# Altium schematic sheet Pacemaker V3_0.SchDoc
size 723 x 392 mm; Origin: Eagle
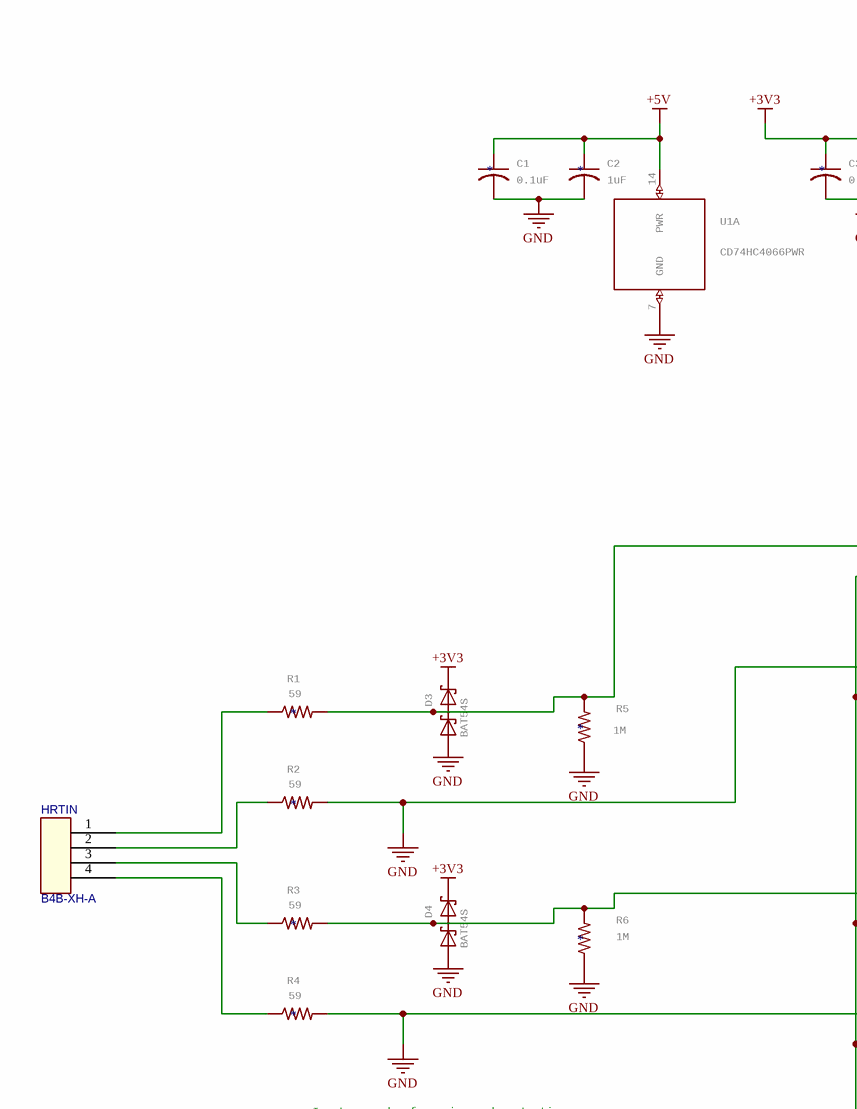
[diagram p0: Pacemaker V3_0.SchDoc, top left]
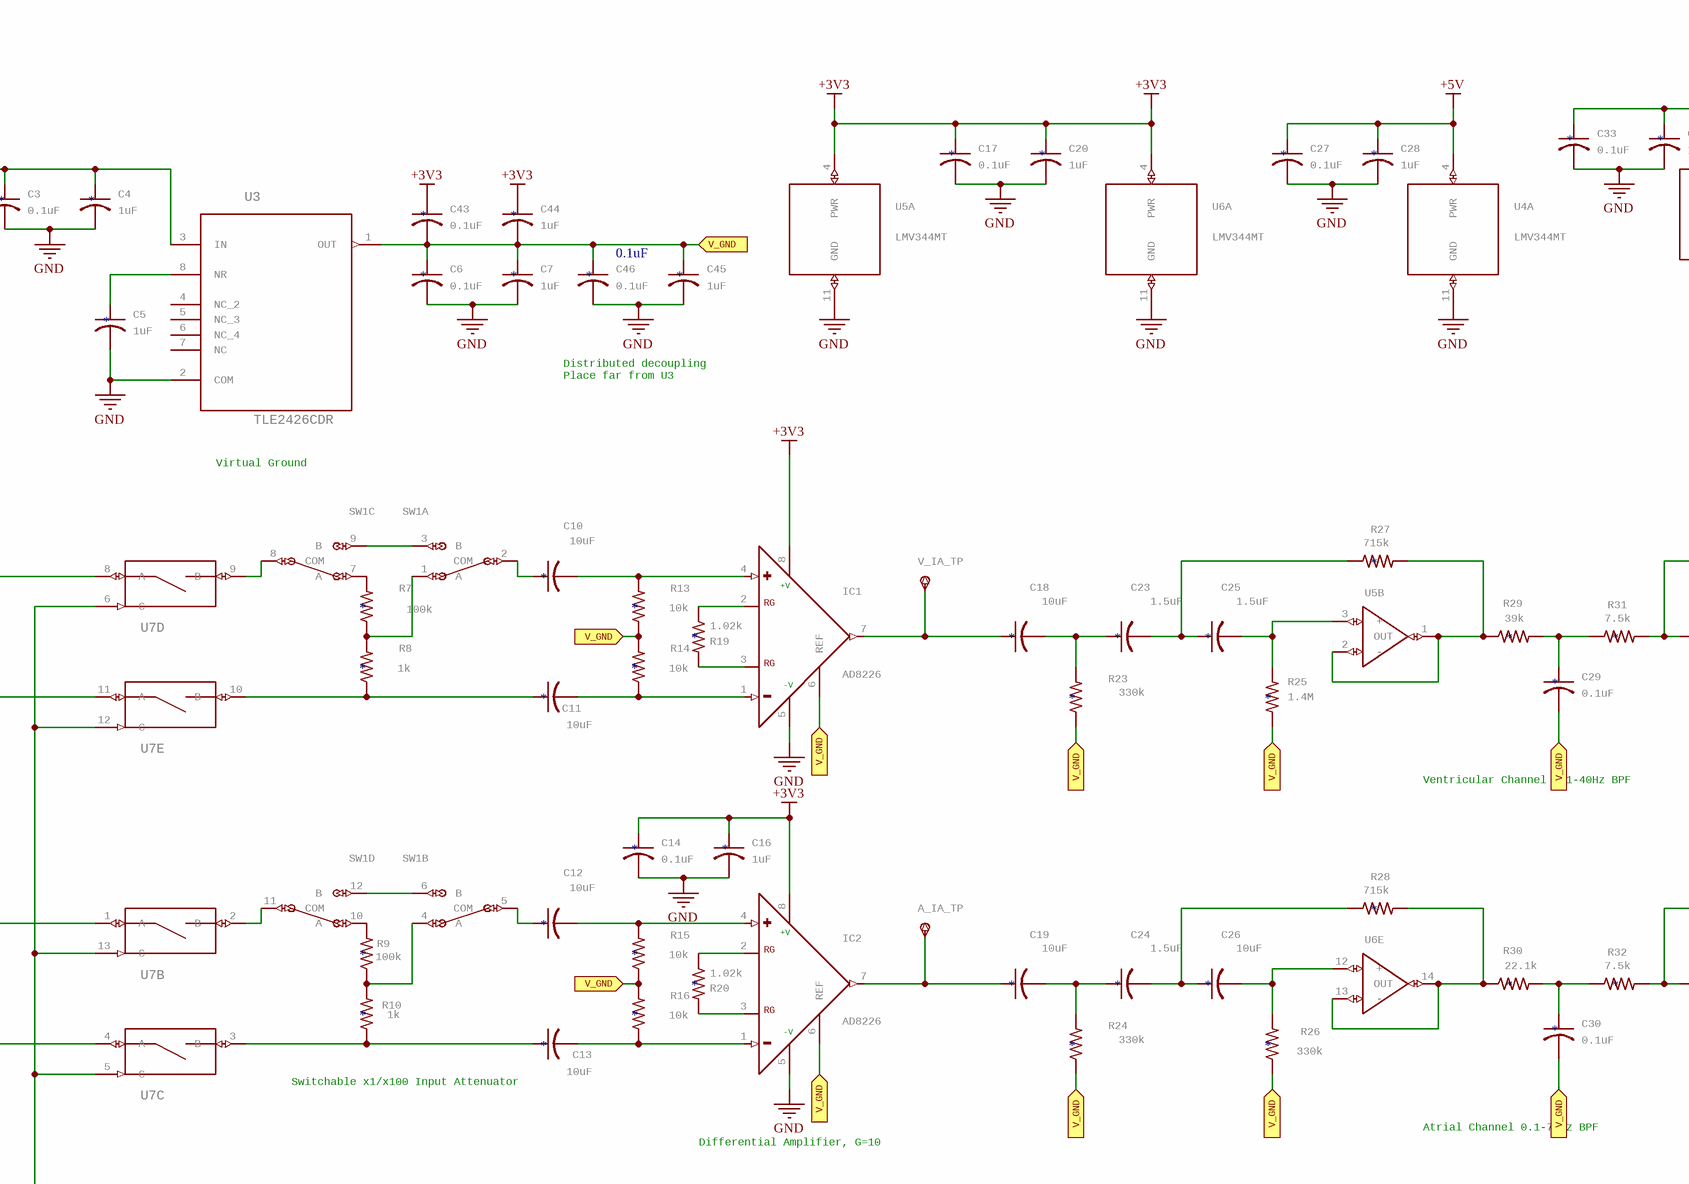
[diagram p1: Pacemaker V3_0.SchDoc, top middle]
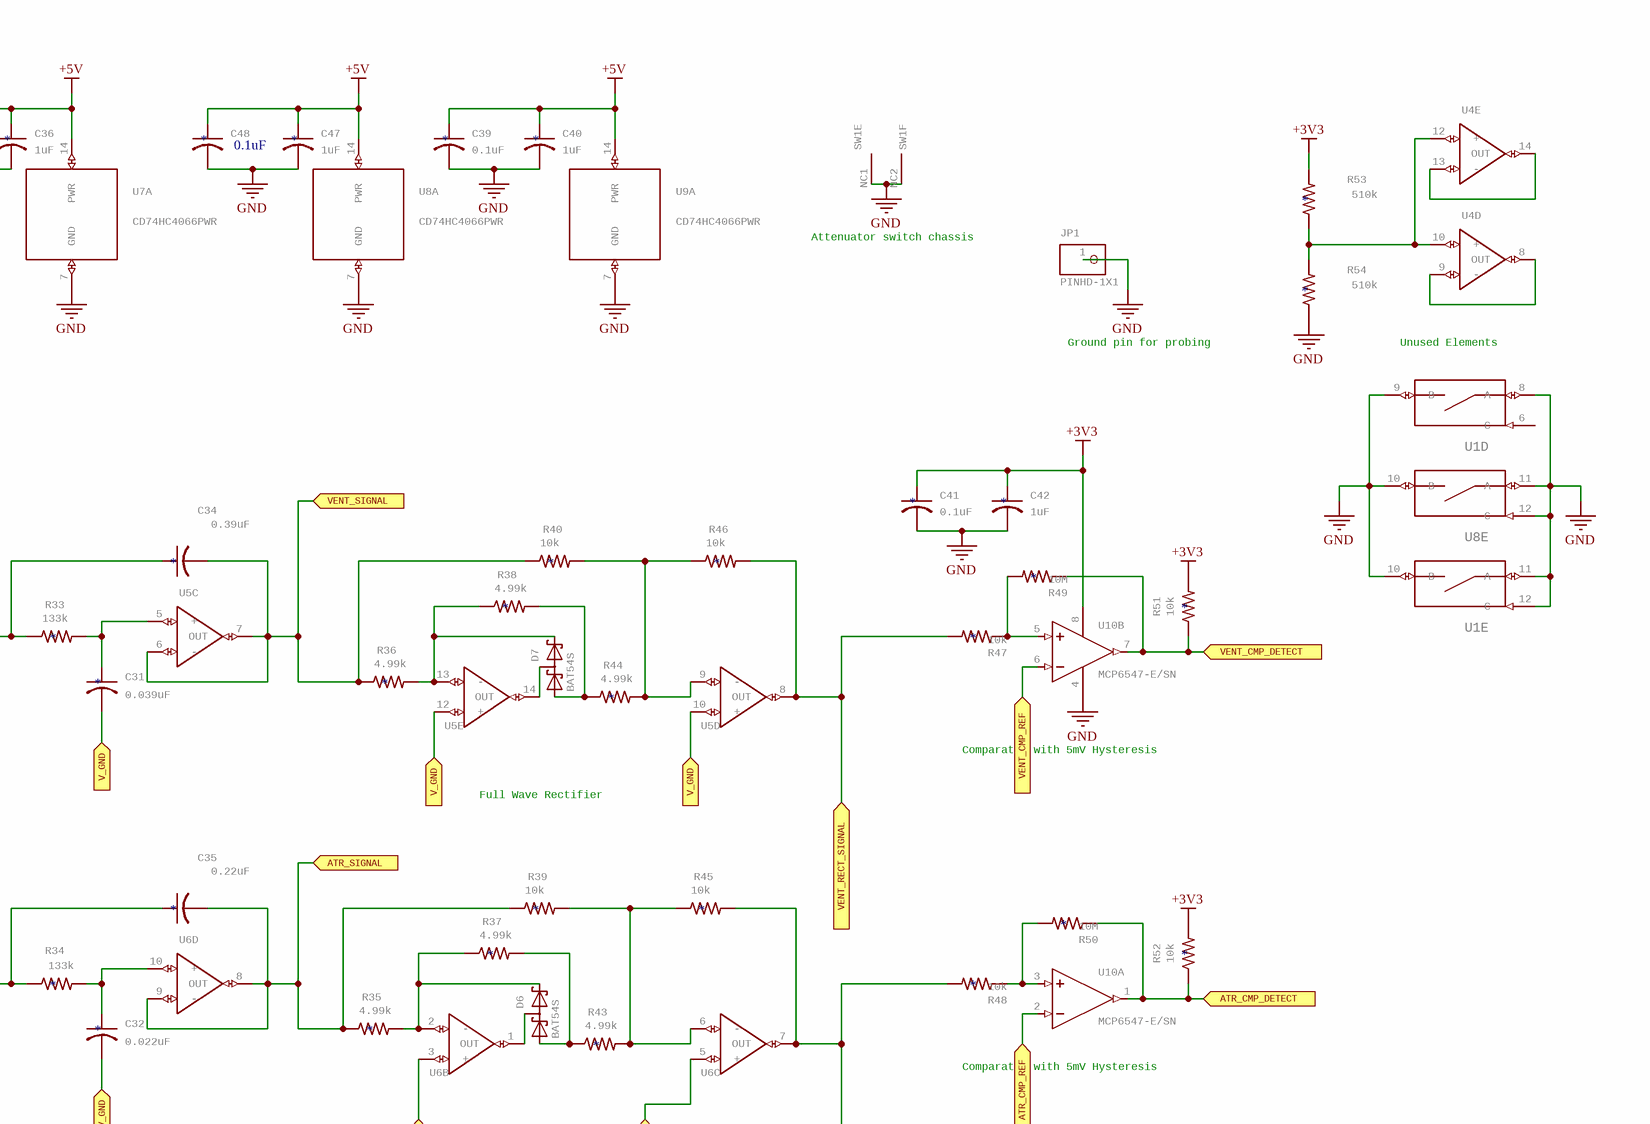
[diagram p2: Pacemaker V3_0.SchDoc, top right]
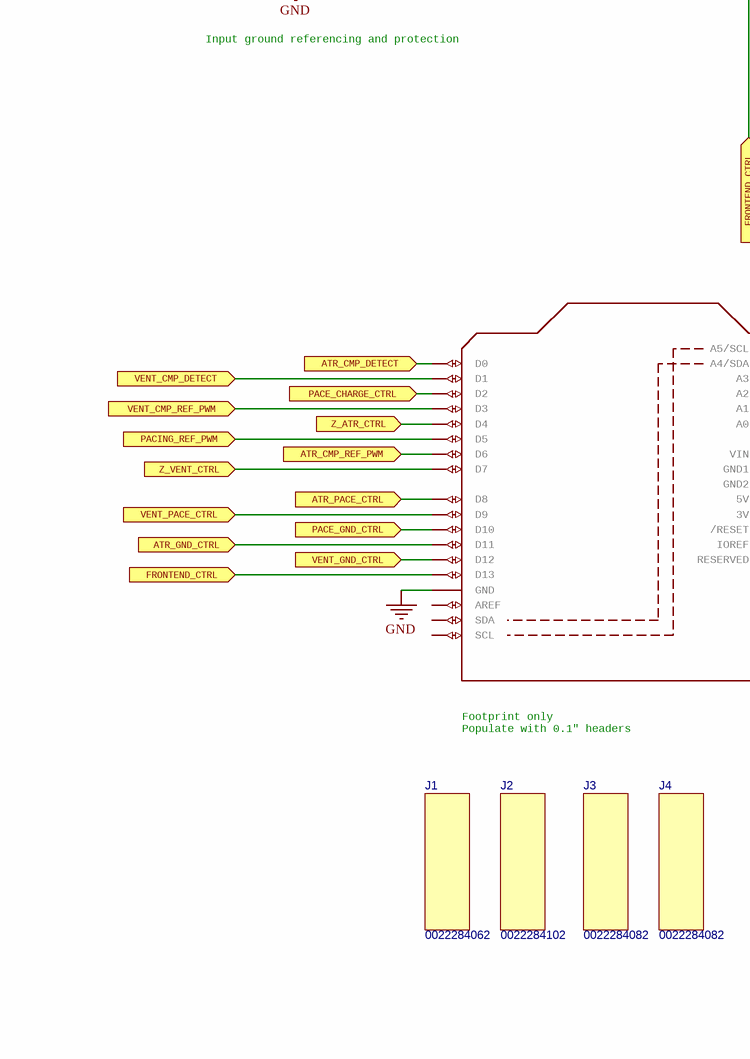
[diagram p3: Pacemaker V3_0.SchDoc, bottom left]
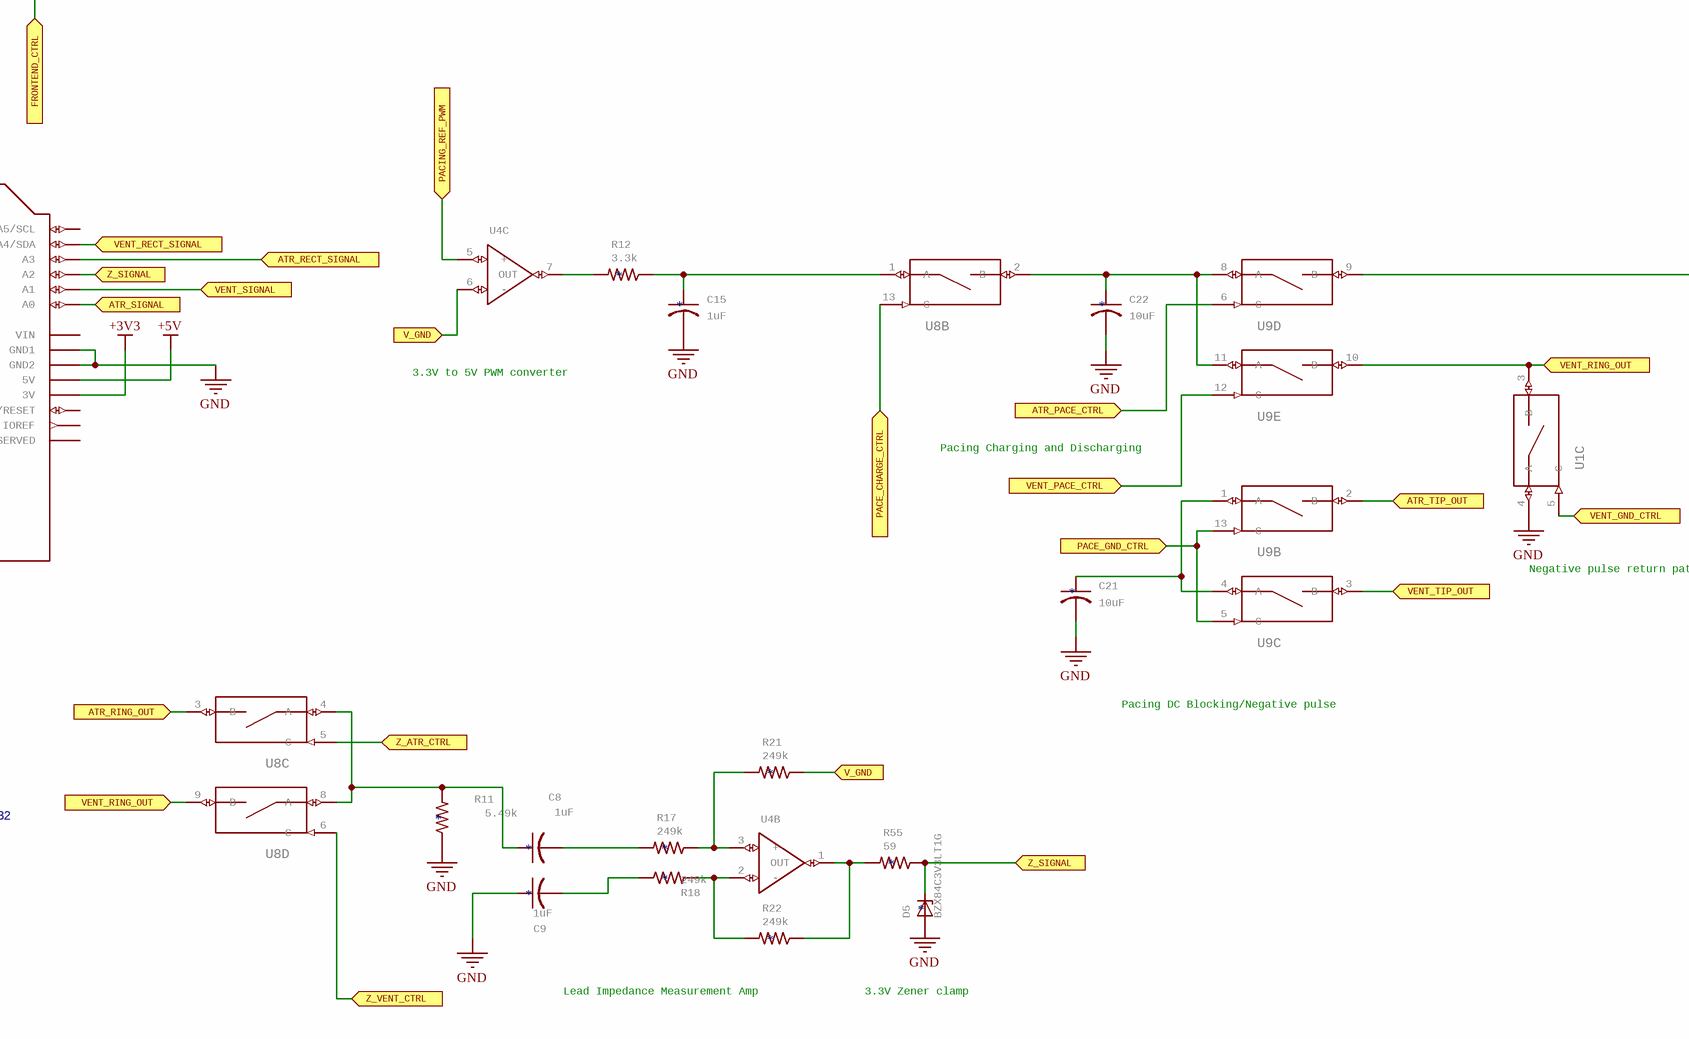
[diagram p4: Pacemaker V3_0.SchDoc, bottom middle]
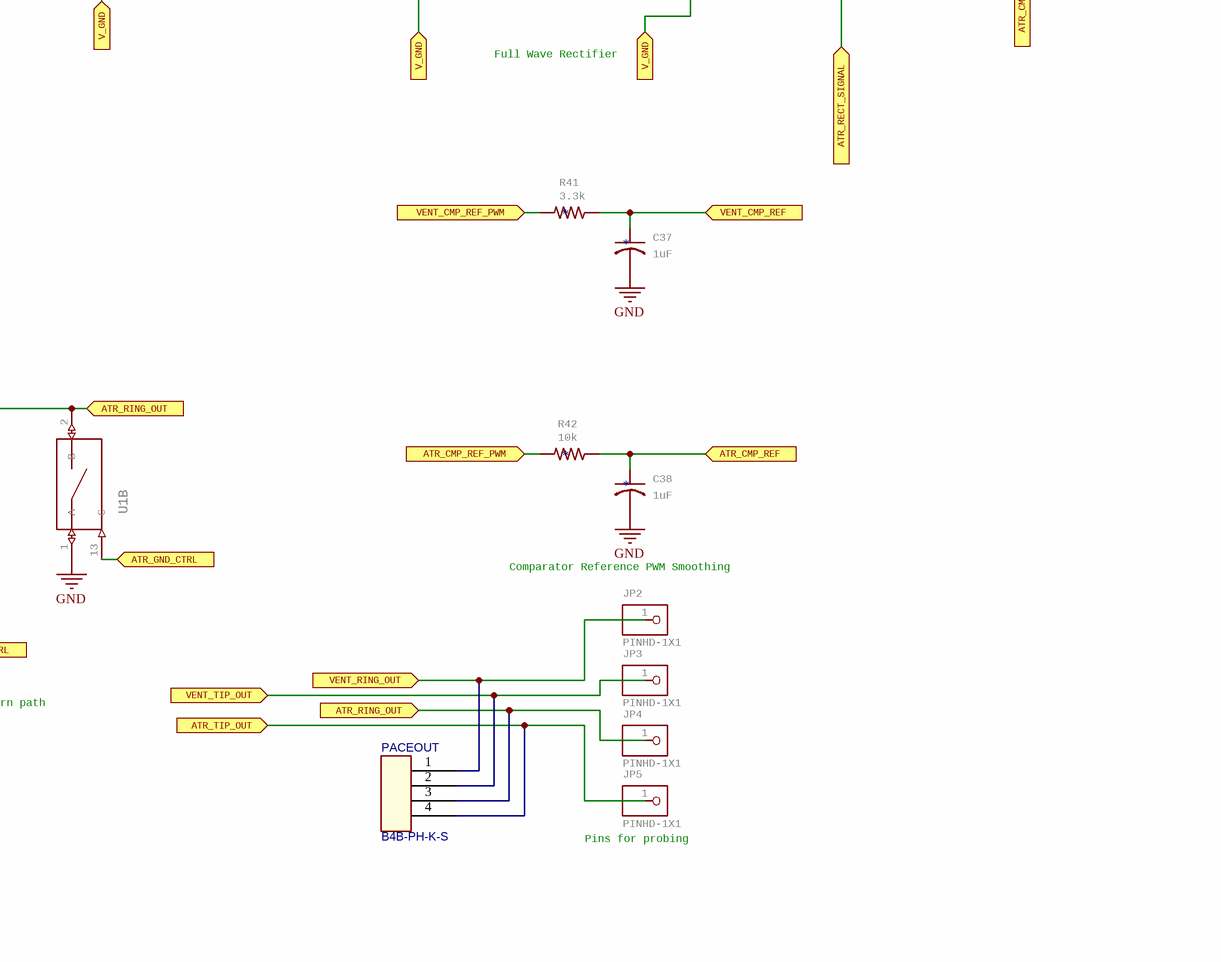
[diagram p5: Pacemaker V3_0.SchDoc, bottom right]

## Parts
A_IA_TP  TPSTP06R  [TP06R]  (value not drawn)
C1  *  value 0.1uF  [C0805]
C2  *  value 1uF  [C0805]
C3  *  value 0.1uF  [C0805]
C4  *  value 1uF  [C0805]
C5  *  value 1uF  [C0805]
C6  *  value 0.1uF  [C0805]
C7  *  value 1uF  [C0805]
C8  *  value 1uF  [C0805]
C9  *  value 1uF  [C0805]
C10  *  value 10uF  [C0805]
C11  *  value 10uF  [C0805]
C12  *  value 10uF  [C0805]
C13  *  value 10uF  [C0805]
C14  *  value 0.1uF  [C0805]
C15  *  value 1uF  [C0805]
C16  *  value 1uF  [C0805]
C17  *  value 0.1uF  [C0805]
C18  *  value 10uF  [C0805]
C19  *  value 10uF  [C0805]
C20  *  value 1uF  [C0805]
C21  *  value 10uF  [C0805]
C22  *  value 10uF  [C0805]
C23  *  value 1.5uF  [C0805]
C24  *  value 1.5uF  [C0805]
C25  *  value 1.5uF  [C0805]
C26  *  value 10uF  [C0805]
C27  *  value 0.1uF  [C0805]
C28  *  value 1uF  [C0805]
C29  *  value 0.1uF  [C0805]
C30  *  value 0.1uF  [C0805]
C31  *  value 0.039uF  [C0805]
C32  *  value 0.022uF  [C0805]
C33  *  value 0.1uF  [C0805]
C34  *  value 0.39uF  [C0805]
C35  *  value 0.22uF  [C0805]
C36  *  value 1uF  [C0805]
C37  *  value 1uF  [C0805]
C38  *  value 1uF  [C0805]
C39  *  value 0.1uF  [C0805]
C40  *  value 1uF  [C0805]
C41  *  value 0.1uF  [C0805]
C42  *  value 1uF  [C0805]
C43  *  value 0.1uF  [C0805]
C44  *  value 1uF  [C0805]
C45  *  value 1uF  [C0805]
C46  *  value 0.1uF  [C0805]
C47  *  value 1uF  [C0805]
C48  *  [C0805]
D3  BAT54S  [SOT23]
D4  BAT54S  [SOT23]
D5  *  value BZX84C3V3LT1G  [SOT23]
D6  BAT54S  [SOT23]
D7  BAT54S  [SOT23]
HRTIN  B4B-XH-A  [B4B-XH-A]
IC1  AD8226  [SOIC8_SMTC]
IC2  AD8226  [SOIC8_SMTC]
J1  0022284062  [LHS-06-TS_OUTLINE]
J2  0022284102  [LHS-10-TS_OUTLINE]
J3  0022284082  [LHS-08-TS_OUTLINE]
J4  0022284082  [LHS-08-TS_OUTLINE]
JP1  PINHD-1X1  [1X01]
JP2  PINHD-1X1  [1X01]
JP3  PINHD-1X1  [1X01]
JP4  PINHD-1X1  [1X01]
JP5  PINHD-1X1  [1X01]
PACEOUT  B4B-PH-K-S  [B4B-PH-K-S]
R1  *  value 59  [R0805]
R2  *  value 59  [R0805]
R3  *  value 59  [R0805]
R4  *  value 59  [R0805]
R5  *  value 1M  [R0805]
R6  *  value 1M  [R0805]
R7  *  value 100k  [R0805]
R8  *  value 1k  [R0805]
R9  *  value 100k  [R0805]
R10  *  value 1k  [R0805]
R11  *  value 5.49k  [R0805]
R12  *  value 3.3k  [R0805]
R13  *  value 10k  [R0805]
R14  *  value 10k  [R0805]
R15  *  value 10k  [R0805]
R16  *  value 10k  [R0805]
R17  *  value 249k  [R0805]
R18  *  value 249k  [R0805]
R19  *  value 1.02k  [R0805]
R20  *  value 1.02k  [R0805]
R21  *  value 249k  [R0805]
R22  *  value 249k  [R0805]
R23  *  value 330k  [R0805]
R24  *  value 330k  [R0805]
R25  *  value 1.4M  [R0805]
R26  *  value 330k  [R0805]
R27  *  value 715k  [R0805]
R28  *  value 715k  [R0805]
R29  *  value 39k  [R0805]
R30  *  value 22.1k  [R0805]
R31  *  value 7.5k  [R0805]
R32  *  value 7.5k  [R0805]
R33  *  value 133k  [R0805]
R34  *  value 133k  [R0805]
R35  *  value 4.99k  [R0805]
R36  *  value 4.99k  [R0805]
R37  *  value 4.99k  [R0805]
R38  *  value 4.99k  [R0805]
R39  *  value 10k  [R0805]
R40  *  value 10k  [R0805]
R41  *  value 3.3k  [R0805]
R42  *  value 10k  [R0805]
R43  *  value 4.99k  [R0805]
R44  *  value 4.99k  [R0805]
R45  *  value 10k  [R0805]
R46  *  value 10k  [R0805]
R47  *  value 10k  [R0805]
R48  *  value 10k  [R0805]
R49  *  value 10M  [R0805]
R50  *  value 10M  [R0805]
R51  *  value 10k  [R0805]
R52  *  value 10k  [R0805]
R53  *  value 510k  [R0805]
R54  *  value 510k  [R0805]
R55  *  value 59  [R0805]
SW1  EG4208  [EG4208-PACKAGE]  (value not drawn)  (parts A,B,C,D,E,F of 6)
U1  CD74HC4066PWR  [SOP65P640X110-14N]  (parts A,B,C,D,E of 5)
U2  ARDUINOR3-DIMENSION  [ARDUINOR3]  (value not drawn)
U3  TLE2426CDR  [SOIC127P600X175-8N]
U4  LMV344MT  [SOP65P640X110-14N]  (parts A,B,C,D,E of 5)
U5  LMV344MT  [SOP65P640X110-14N]  (parts A,B,C,D,E of 5)
U6  LMV344MT  [SOP65P640X110-14N]  (parts A,B,C,D,E of 5)
U7  CD74HC4066PWR  [SOP65P640X110-14N]  (parts A,B,C,D,E of 5)
U8  CD74HC4066PWR  [SOP65P640X110-14N]  (parts A,B,C,D,E of 5)
U9  CD74HC4066PWR  [SOP65P640X110-14N]  (parts A,B,C,D,E of 5)
U10  MCP6547-E/SN  [SOIC127P600X175-8N]  (parts A,B of 2)
V_IA_TP  TPSTP06R  [TP06R]  (value not drawn)

## Ports
ATR_CMP_DETECT (in), ATR_CMP_REF (in), ATR_CMP_REF_PWM (in), ATR_GND_CTRL (in), ATR_PACE_CTRL (in), ATR_RECT_SIGNAL (in), ATR_RING_OUT (in), ATR_SIGNAL (in), ATR_TIP_OUT (in), FRONTEND_CTRL (in), PACE_CHARGE_CTRL (in), PACE_GND_CTRL (in), PACING_REF_PWM (in), V_GND (in), VENT_CMP_DETECT (in), VENT_CMP_REF (in), VENT_CMP_REF_PWM (in), VENT_GND_CTRL (in), VENT_PACE_CTRL (in), VENT_RECT_SIGNAL (in), VENT_RING_OUT (in), VENT_SIGNAL (in), VENT_TIP_OUT (in), Z_ATR_CTRL (in), Z_SIGNAL (in), Z_VENT_CTRL (in)

## Nets
+3V3: C3.1 C4.1 C14.1 C16.1 C17.1 C20.1 C41.1 C42.1 C43.1 C44.1 D3.2(C2) D4.2(C2) IC1.8(+V) IC2.8(+V) R51.2 R52.2 R53.2 U2.3V U3.3(IN) U5.4(PWR) U6.4(PWR) U10.8(V+)
+5V: C1.1 C2.1 C27.1 C28.1 C33.1 C36.1 C39.1 C40.1 C47.1 C48.1 U1.14(PWR) U2.5V U4.4(PWR) U7.14(PWR) U8.14(PWR) U9.14(PWR)
GND: C1.2 C2.2 C3.2 C4.2 C5.2 C6.2 C7.2 C9.1 C14.2 C15.2 C16.2 C17.2 C20.2 C21.2 C22.2 C27.2 C28.2 C33.2 C36.2 C37.2 C38.2 C39.2 C40.2 C41.2 C42.2 C45.2 C46.2 C47.2 C48.2 D3.1(A1) D4.1(A1) D5.1(A) IC1.5(-V) IC2.5(-V) JP1.1 R2.2 R4.2 R5.1 R6.1 R11.1 R54.1 SW1.NC1(V-) SW1.NC2(V-) U1.1(A) U1.4(A) U1.7(GND) U1.8(A) U1.9(B) U1.10(B) U1.11(A) U1.12(C) U2.GND U2.GND1 U2.GND2 U3.2(COM) U4.11(GND) U5.11(GND) U6.11(GND) U7.4(A) U7.7(GND) U7.11(A) U8.7(GND) U8.10(B) U8.11(A) U8.12(C) U9.7(GND) U10.4(V-)
ATR_CMP_DETECT: R50.1 R52.1 U2.D0 U10.1(OUT) ; port ATR_CMP_DETECT
ATR_CMP_REF: C38.1 R42.1 U10.2(-IN) ; port ATR_CMP_REF
ATR_CMP_REF_PWM: R42.2 U2.D6 ; port ATR_CMP_REF_PWM
ATR_GND_CTRL: U1.13(C) U2.D11 ; port ATR_GND_CTRL
ATR_PACE_CTRL: U2.D8 U9.6(C) ; port ATR_PACE_CTRL
ATR_RECT_SIGNAL: R45.2 R48.2 U2.A3 U6.7(OUT) ; port ATR_RECT_SIGNAL
ATR_RING_OUT: JP4.1 PACEOUT.3 U1.2(B) U8.3(B) U9.9(B) ; port ATR_RING_OUT
ATR_SIGNAL: C35.2 R35.1 R39.1 U2.A0 U6.8(OUT) U6.9(-) ; port ATR_SIGNAL
ATR_TIP_OUT: JP5.1 PACEOUT.4 U9.2(B) ; port ATR_TIP_OUT
FRONTEND_CTRL: U2.D13 U7.5(C) U7.6(C) U7.12(C) U7.13(C) ; port FRONTEND_CTRL
PACE_CHARGE_CTRL: U2.D2 U8.13(C) ; port PACE_CHARGE_CTRL
PACE_GND_CTRL: U2.D10 U9.5(C) U9.13(C) ; port PACE_GND_CTRL
PACING_REF_PWM: U2.D5 U4.5(+) ; port PACING_REF_PWM
V_GND: C6.1 C7.1 C29.2 C30.2 C31.2 C32.2 C43.2 C44.2 C45.1 C46.1 IC1.6(REF) IC2.6(REF) R13.1 R14.2 R15.1 R16.2 R21.1 R23.1 R24.1 R25.1 R26.1 U3.1(OUT) U4.6(-) U5.10(+) U5.12(+) U6.3(+) U6.5(+) ; port V_GND
VENT_CMP_DETECT: R49.1 R51.1 U2.D1 U10.7(OUT) ; port VENT_CMP_DETECT
VENT_CMP_REF: C37.1 R41.1 U10.6(-IN) ; port VENT_CMP_REF
VENT_CMP_REF_PWM: R41.2 U2.D3 ; port VENT_CMP_REF_PWM
VENT_GND_CTRL: U1.5(C) U2.D12 ; port VENT_GND_CTRL
VENT_PACE_CTRL: U2.D9 U9.12(C) ; port VENT_PACE_CTRL
VENT_RECT_SIGNAL: R46.2 R47.2 U2.A4(A4/SDA) U5.8(OUT) ; port VENT_RECT_SIGNAL
VENT_RING_OUT: JP2.1 PACEOUT.1 U1.3(B) U8.9(B) U9.10(B) ; port VENT_RING_OUT
VENT_SIGNAL: C34.2 R36.1 R40.1 U2.A1 U5.6(-) U5.7(OUT) ; port VENT_SIGNAL
VENT_TIP_OUT: JP3.1 PACEOUT.2 U9.3(B) ; port VENT_TIP_OUT
Z_ATR_CTRL: U2.D4 U8.5(C) ; port Z_ATR_CTRL
Z_SIGNAL: D5.3(C) R55.1 U2.A2 ; port Z_SIGNAL
Z_VENT_CTRL: U2.D7 U8.6(C) ; port Z_VENT_CTRL
NetA_IA_TP_TP: A_IA_TP.TP(PP) C19.1 IC2.7(OUT)
NetC5_1: C5.1 U3.8(NR)
NetC8_1: C8.1 R11.2 U8.4(A) U8.8(A)
NetC8_2: C8.2 R17.2
NetC9_2: C9.2 R18.1
NetC10_1: C10.1 SW1.2(COM)
NetC10_2: C10.2 IC1.4(+) R13.2
NetC11_1: C11.1 R8.1 U7.10(B)
NetC11_2: C11.2 IC1.1(-) R14.1
NetC12_1: C12.1 SW1.5(COM)
NetC12_2: C12.2 IC2.4(+) R15.2
NetC13_1: C13.1 R10.1 U7.3(B)
NetC13_2: C13.2 IC2.1(-) R16.1
NetC15_1: C15.1 R12.1 U8.1(A)
NetC18_1: C18.1 IC1.7(OUT) V_IA_TP.TP(PP)
NetC18_2: C18.2 C23.1 R23.2
NetC19_2: C19.2 C24.1 R24.2
NetC21_1: C21.1 U9.1(A) U9.4(A)
NetC22_1: C22.1 U8.2(B) U9.8(A) U9.11(A)
NetC23_2: C23.2 C25.1 R27.1
NetC24_2: C24.2 C26.1 R28.1
NetC25_2: C25.2 R25.2 U5.3(+)
NetC26_2: C26.2 R26.2 U6.12(+)
NetC29_1: C29.1 R29.2 R31.1
NetC30_1: C30.1 R30.2 R32.1
NetC31_1: C31.1 R33.2 U5.5(+)
NetC32_1: C32.1 R34.2 U6.10(+)
NetC34_1: C34.1 R31.2 R33.1
NetC35_1: C35.1 R32.2 R34.1
NetD3_3: D3.3(C1A2) R1.2 R5.2 U7.8(A)
NetD4_3: D4.3(C1A2) R3.2 R6.2 U7.1(A)
NetD6_1: D6.1(A1) R37.2 R43.1
NetD6_2: D6.2(C2) R35.2 R37.1 U6.2(-)
NetD6_3: D6.3(C1A2) U6.1(OUT)
NetD7_1: D7.1(A1) R38.2 R44.1
NetD7_2: D7.2(C2) R36.2 R38.1 U5.13(-)
NetD7_3: D7.3(C1A2) U5.14(OUT)
NetHRTIN_1: HRTIN.1 R1.1
NetHRTIN_2: HRTIN.2 R2.1
NetHRTIN_3: HRTIN.3 R3.1
NetHRTIN_4: HRTIN.4 R4.1
NetIC1_2: IC1.2(RG) R19.1
NetIC1_3: IC1.3(RG) R19.2
NetIC2_2: IC2.2(RG) R20.1
NetIC2_3: IC2.3(RG) R20.2
NetR7_1: R7.1 R8.2 SW1.1(A)
NetR7_2: R7.2 SW1.7(A)
NetR9_1: R9.1 R10.2 SW1.4(A)
NetR9_2: R9.2 SW1.10(A)
NetR12_2: R12.2 U4.7(OUT)
NetR17_1: R17.1 R21.2 U4.3(+)
NetR18_2: R18.2 R22.2 U4.2(-)
NetR22_1: R22.1 R55.2 U4.1(OUT)
NetR27_2: R27.2 R29.1 U5.1(OUT) U5.2(-)
NetR28_2: R28.2 R30.1 U6.13(-) U6.14(OUT)
NetR39_2: R39.2 R43.2 R45.1 U6.6(-)
NetR40_2: R40.2 R44.2 R46.1 U5.9(-)
NetR47_1: R47.1 R49.2 U10.5(+IN)
NetR48_1: R48.1 R50.2 U10.3(+IN)
NetR53_1: R53.1 R54.2 U4.10(+) U4.12(+)
NetSW1_3: SW1.3(B) SW1.9(B)
NetSW1_6: SW1.6(B) SW1.12(B)
NetSW1_8: SW1.8(COM) U7.9(B)
NetSW1_11: SW1.11(COM) U7.2(B)
NetU4_8: U4.8(OUT) U4.9(-)
NetU4_13: U4.13(-) U4.14(OUT)

Not connected (* = marked no-connect by the designer): U1 6(C); U2 A5(A5/SCL) AREF IOREF RESERVED RESET(/RESET) SCL SDA VIN; U3 4(NC_2) 5(NC_3) 6(NC_4) 7(NC)

## Notes on the sheet
- Attenuator switch chassis
- Ground pin for probing
- Unused Elements
- Distributed decoupling
  Place far from U3
- Virtual Ground
- Ventricular Channel 0.1-40Hz BPF
- Full Wave Rectifier
- Comparator with 5mV Hysteresis
- Switchable x1/x100 Input Attenuator
- (near U10) Comparator with 5mV Hysteresis
- Input ground referencing and protection
- Differential Amplifier, G=10
- Atrial Channel 0.1-70Hz BPF
- 3.3V to 5V PWM converter
- Pacing Charging and Discharging
- Comparator Reference PWM Smoothing
- Footprint only
  Populate with 0.1" headers
- Negative pulse return path
- Pacing DC Blocking/Negative pulse
- (near JP5) Pins for probing
- (near R22) Lead Impedance Measurement Amp
- 3.3V Zener clamp

## Library data of the parts
A_IA_TP V_IA_TP = TPSTP06R: TEST PIN
  V_IA_TP: Value: TPSTP06R
C1-C47 = C-USC0805: CAPACITOR, American symbol
C48 = C-USC0805: CAPACITOR, American symbol; Value: 0.1uF
D3 D4 D6 D7 = BAT54S: Schottky Diodes   Pin connection corrected 2011-05-04 Source: Fairchild .. BAT54.pdf; Value: BAT54S
D5 = ZENER-DIODESOT23: Z-Diode
HRTIN = CON4: Conn mFit 2x2M Strgt.; Manufacturer: Molex; Value: B4B-XH-A; Price: 0
IC1 IC2 = AD8226: Wide Supply Range, Rail-to-Rail Output Instrumentation Amplifier; MPN: AD623ARZ.; GateName_1: G$1; DeviceName: R; DeviceSetName: AD8266; SymbolName_1: AD8226; LibraryName: analog-devices; MF: MF; OC_FARNELL: 9426213; OC_NEWARK: 31M4186; +V: +V; -V: -V; RG: RG
J1 = SIP Header 6 Outline: CONN HEADER VERT 6POS 2.54MM; Manufacturer: Molex; Value: 0022284062; Price: 0.17
J2 = SIP Header 10 Outline: CONN HEADER VERT 10POS 2.54MM; Manufacturer: Molex; Value: 0022284102; Price: 0.31
J3 J4 = SIP Header 8 Outline: CONN HEADER VERT 8POS 2.54MM; Manufacturer: Molex; Value: 0022284082; Price: 0.25
JP1-JP5 = PINHD-1X1: PIN HEADER; Value: PINHD-1X1
PACEOUT = CON4: Conn mFit 2x2M Strgt.; Manufacturer: Molex; Value: B4B-XH-A; Price: 0
R1-R55 = R-US_R0805: RESISTOR, American symbol
U2 = ARDUINOR3-DIMENSION: This is a new object for the new Arduino R3 - with extra pins that you may want to use (such as IOref, and duplicated A4/A5; Value: ARDUINOR3-DIMENSION
U3 = TLE2426CDR: Precision Virtual Ground; Value: TLE2426CDR
U10 = MCP6547-E/SN: Open-Drain Output Sub-Microamp Comparators; Value: MCP6547-E/SN
SW1 = EG4208: Value: EG4208
U1 U7-U9 = CD74HC4066PWR: Value: CD74HC4066PWR
U4-U6 = LMV344MT: Value: LMV344MT